# EAGLE design TinyQED (EAGLE 5.11)
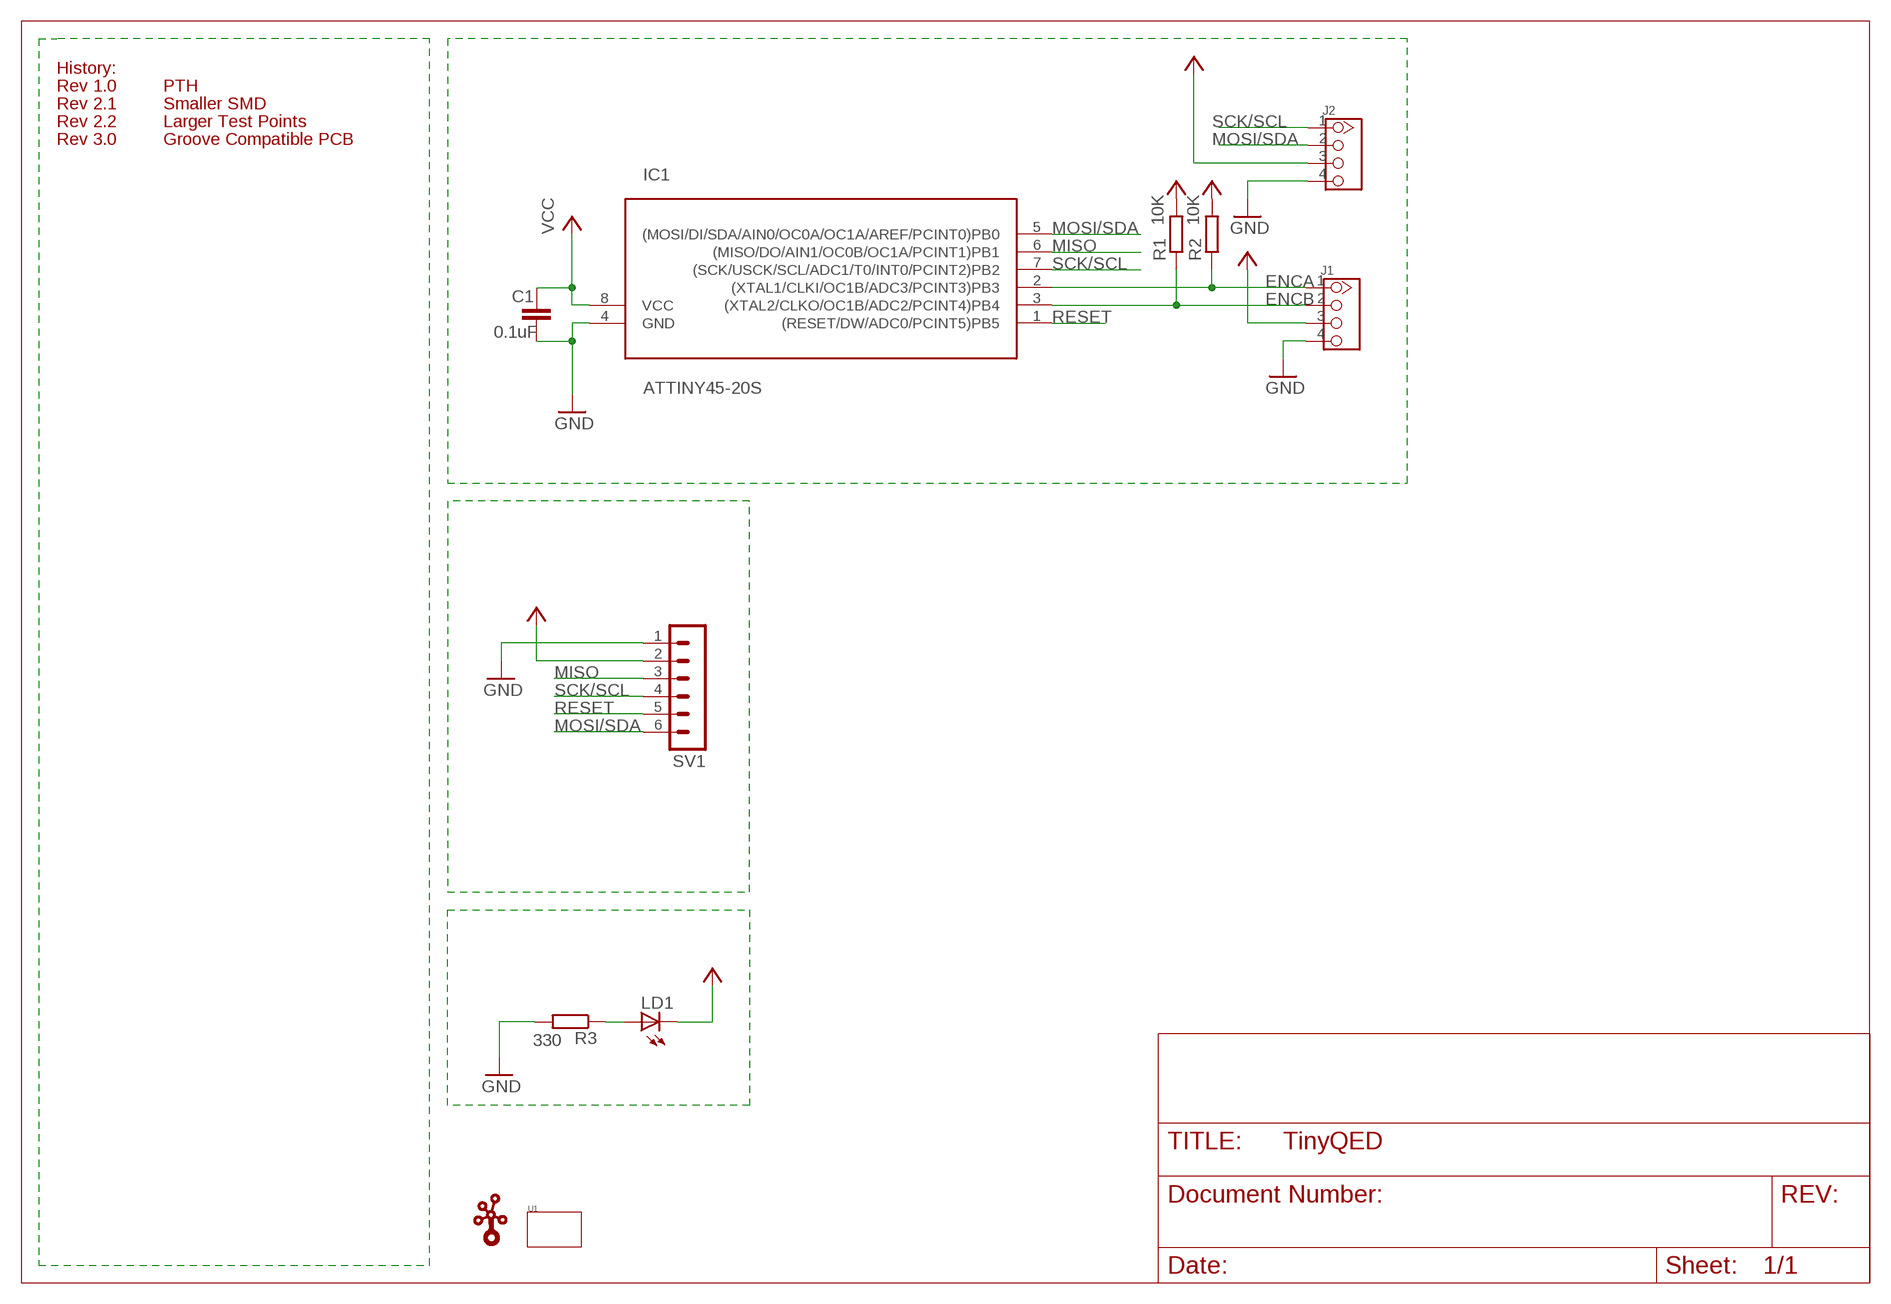
[diagram p0: schematic, sheet 1]

## Parts
C1  0.1uF  C-EUC0805  [C0805]
IC1  ATTINY45-20S  [SOIC8]
J1  TWIG_2.0  [2.0_1X4]
J2  TWIG_2.0  [2.0_1X4]
LD1  LEDCHIP-LED0805  [CHIP-LED0805]
R1  10K  R-EU_M0805  [M0805]
R2  10K  R-EU_M0805  [M0805]
R3  330  R-EU_M0805  [M0805]
SV1  MA06-1  [MA06-1]
U1  TWIG-2U  [2U-DIM-W/-DRILL]
U$1  LOGO-TWIGTWIGLOGO_SMALL  [TWIGLOGO_SMALL]

## Nets
ENCA: IC1.2((XTAL1/CLKI/OC1B/ADC3/PCINT3)PB3) J1.1 R2.1
ENCB: IC1.3((XTAL2/CLKO/OC1B/ADC2/PCINT4)PB4) J1.2 R1.1
GND: C1.2 IC1.4(GND) J1.4 J2.4 R3.2 SV1.1
MISO: IC1.6((MISO/DO/AIN1/OC0B/OC1A/PCINT1)PB1) SV1.3
MOSI/SDA: IC1.5((MOSI/DI/SDA/AIN0/OC0A/OC1A/AREF/PCINT0)PB0) J2.2 SV1.6
N$1: LD1.A R3.1
RESET: IC1.1((RESET/DW/ADC0/PCINT5)PB5) SV1.5
SCK/SCL: IC1.7((SCK/USCK/SCL/ADC1/T0/INT0/PCINT2)PB2) J2.1 SV1.4
VCC: C1.1 IC1.8(VCC) J1.3 J2.3 LD1.C R1.2 R2.2 SV1.2

## Notes on the sheet
- History:
- Rev 1.0 | PTH
- Rev 2.1 | Smaller SMD
- Rev 2.2 | Larger Test Points
- Rev 3.0 | Groove Compatible PCB

## Library data of the parts
C1 = rcl:C-EU: CAPACITOR, European symbol
IC1 = avr:ATTINY45: MICROCONTROLLER 4 Kbytes FLASH 256 bytes EEPROM 256 bytes RAM 4-channel 10 bit ADC USI
J1 J2 = CONNECTER:TWIG_2.0
LD1 = led:LED: LED OSRAM: - CHIPLED LG R971, LG N971, LY N971, LG Q971, LY Q971, LO R971, LY R971 LH N974, LH R974 LS Q976, LO Q976, LY Q976 LO Q996 - Hyper CHIPLED LW Q18S LB Q993, LB Q99A, LB R99A - SideLED LS A670, LO A670, LY A670, LG A670, LP A670 LB A673, LV A673, LT A673, LW A673 LH A674 LY A675 LS A676, LA A676, LO A676, LY A676, LW A676 LS A679, LY A679, LG A679 - Hyper Micro SIDELED® LS Y876, LA Y876, LO Y876, LY Y876 LT Y87S - SmartLED LW L88C, LW L88S LB L89C, LB L89S, LG L890 LS L89K, LO L89K, LY L89K LS L896, LA L896, LO L896, LY L896 - TOPLED LS T670, LO T670, LY T670, LG T670, LP T670 LSG T670, LSP T670, LSY T670, LOP T670, LYG T670 LG T671, LOG T671, LSG T671 LB T673, LV T673, LT T673, LW T673 LH T674 LS T676, LA T676, LO T676, LY T676, LB T676, LH T676, LSB T676, LW T676 LB T67C, LV T67C, LT T67C, LS T67K, LO T67K, LY T67K, LW E67C LS E67B, LA E67B, LO E67B, LY E67B, LB E67C, LV E67C, LT E67C LW T67C LS T679, LY T679, LG T679 LS T770, LO T770, LY T770, LG T770, LP T770 LB T773, LV T773, LT T773, LW T773 LH T774 LS E675, LA E675, LY E675, LS T675 LS T776, LA T776, LO T776, LY T776, LB T776 LHGB T686 LT T68C, LB T68C - Hyper Mini TOPLED® LB M676 - Mini TOPLED Santana® LG M470 LS M47K, LO M47K, LY M47K Source: http://www.osram.convergy.de LUXEON: - LUMILED® LXK2-PW12-R00, LXK2-PW12-S00, LXK2-PW14-U00, LXK2-PW14-V00 LXK2-PM12-R00, LXK2-PM12-S00, LXK2-PM14-U00 LXK2-PE12-Q00, LXK2-PE12-R00, LXK2-PE12-S00, LXK2-PE14-T00, LXK2-PE14-U00 LXK2-PB12-K00, LXK2-PB12-L00, LXK2-PB12-M00, LXK2-PB14-N00, LXK2-PB14-P00, LXK2-PB14-Q00 LXK2-PR12-L00, LXK2-PR12-M00, LXK2-PR14-Q00, LXK2-PR14-R00 LXK2-PD12-Q00, LXK2-PD12-R00, LXK2-PD12-S00 LXK2-PH12-R00, LXK2-PH12-S00 LXK2-PL12-P00, LXK2-PL12-Q00, LXK2-PL12-R00 Source: www.luxeon.com KINGBRIGHT: KA-3528ASYC Source: www.kingbright.com
R1-R3 = rcl:R-EU_: RESISTOR, European symbol
SV1 = con-lstb:MA06-1: PIN HEADER; OC_FARNELL: unknown; OC_NEWARK: unknown
U1 = Module:TWIG
U$1 = Logo:LOGO-TWIG

## Board
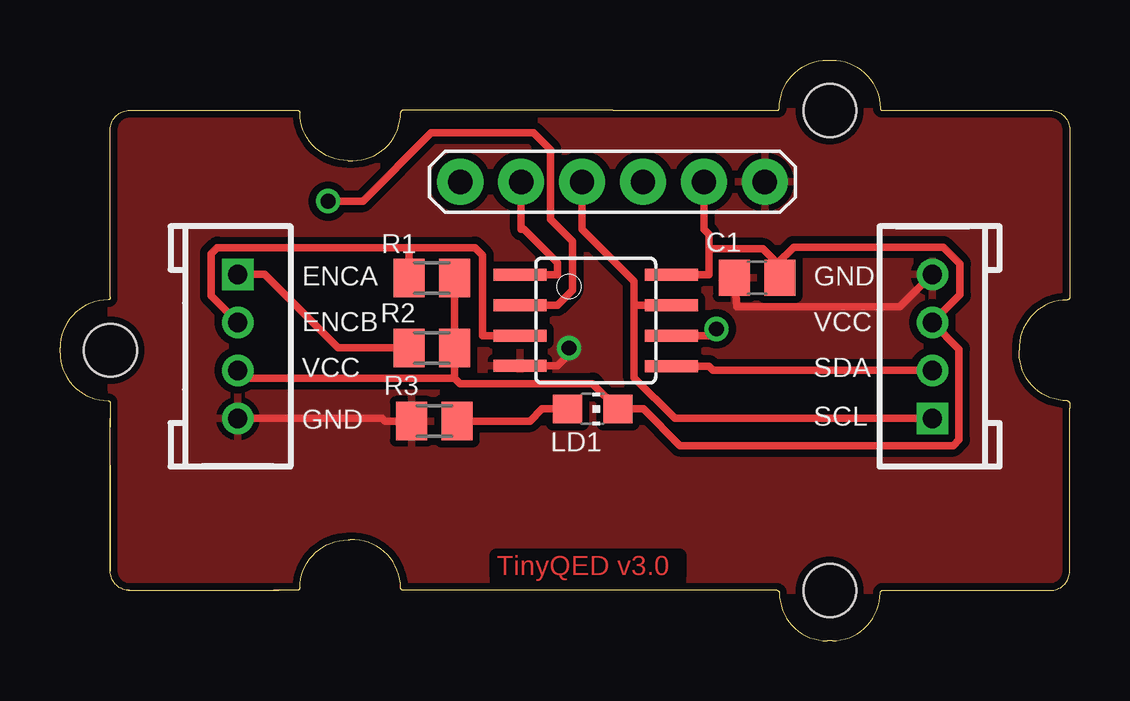
[diagram p1: board, top side]
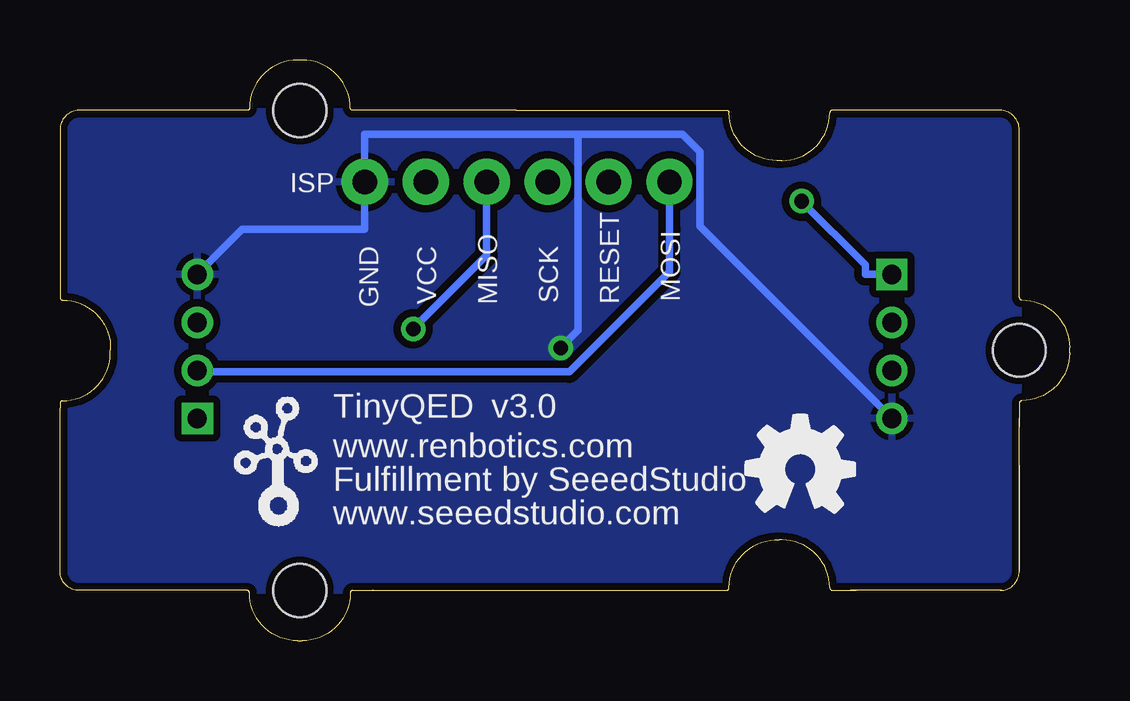
[diagram p2: board, bottom side, seen from below]

Size 42.09 x 24.2 mm. Coordinates in mm from the lower left corner, seen from the top.
Copper layers (1*16): Top 0.035mm / dielectric 1.5mm / Bottom 0.035mm
Design rules "Fusion_eagle_rule_v1.1": minimum track width 6mil, minimum drill 12mil, track to track 6mil, track to pad 6mil, pad to pad 6mil, via to via 6mil, smd to smd 0mil, copper to edge 10mil, drill to drill 10mil, minimum pad ring 10mil, minimum via ring 6mil, stop-mask expansion 2mil, vias tented up to drill 100mil, thermal gap 10mil

### Footprints (pad centres in the part's own frame; a part is rotated, then mirrored left to right if it is on the bottom)
C0805 = smd 1.3 x 1.5: 1 -0.95,0; 2 0.95,0
SOIC8 = smd 0.5 x 2.2: 1 -1.905,-3.154; 2 -0.645,-3.154; 3 0.625,-3.154; 4 1.895,-3.154; 5 1.905,3.154; 6 0.635,3.154; 7 -0.635,3.154; 8 -1.905,3.154
2.0_1X4 = drill 0.8 pad 1.27 square: 1 -3,0 | drill 0.8 pad 1.27 round: 2 -1,0; 3 1,0; 4 3,0
CHIP-LED0805 = smd 1.2 x 1.2: A 0,-1.05; C 0,1.05
M0805 = smd 1.3 x 1.6: 1 -0.95,0; 2 0.95,0
MA06-1 = drill 1.016 pad 1.93 round: 1 -6.35,0; 2 -3.81,0; 3 -1.27,0; 4 1.27,0; 5 3.81,0; 6 6.35,0
2U-DIM-W/-DRILL = hole 2.2: 10.453,-10.42; 10.453,9.58; -19.535,-0.415

### Placement (x,y rotation side)
C1  29.06,15.12 180 top
IC1  22.33,13.35 270 top
J1  7.41,12.27 270 top
J2  36.37,12.27 90 top
LD1  22.21,9.66 270 top
R1  15.5,15.12 0 top
R2  15.5,12.2 0 top
R3  15.6,9.15 180 top
SV1  23.03,19.12 180 top
U1  21.64,12.52 0 top
U$1  35.22,4.65 0 bottom
U$2  [OSHW2]  8.68,5.41 0 top

### Tracks (layer width: path | path; a pad name or v marks a point on that pad's centre or on a via)
ENCA  (via drill 0.61 pad 1.02)
  Top 0.305: IC1.2 20.74,13.99 21.36,14.61 21.36,16.64 20.44,17.56 20.44,20.47 19.74,21.17 15.48,21.17 12.63,18.32 v11.18,18.32 | R2.1 11.59,12.2 8.52,15.27 J1.1
  Bottom 0.305: J1.1 8.52,15.27 8.52,15.66 v11.18,18.32
ENCB
  Top 0.305: J1.2 6.3,14.38 6.3,16.13 6.55,16.38 14.55,16.38 | IC1.3 17.62,12.72 17.62,16.06 17.3,16.38 14.55,16.38 | 14.55,16.38 R1.1
GND  (via drill 0.61 pad 1.02)
  Top 0.305: v21.22,12.2 21.22,11.93 20.74,11.45 IC1.4 | R3.2 13.55,9.15 13.43,9.27 J1.4 | C1.2 28.22,13.92 35.02,13.92 J2.4
  Bottom 0.305: 20.49,21.11 20.49,12.93 v21.22,12.2 | 20.49,21.11 29.38,21.11 SV1.1 29.38,17.14 34.49,17.14 J2.4 | J1.4 15.41,17.27 15.41,20.39 16.13,21.11 20.49,21.11
  pour Top (isolate 0.305): 2.08,22.04 2.2,2.11 42.08,2.11 42.08,22.04
  pour Bottom (isolate 0.305): 2.08,22.04 2.2,2.11 42.08,2.11 42.08,22.04
MISO  (via drill 0.61 pad 1.02)
  Top 0.305: v27.36,12.99 27.33,12.99 27.05,12.71 IC1.6
  Bottom 0.305: SV1.3 24.3,16.06 v27.36,12.99
MOSI/SDA
  Top 0.305: IC1.5 27.05,11.44 27.22,11.27 J2.2
  Bottom 0.305: J2.2 36.31,11.2 20.86,11.2 16.68,15.38 16.68,17.14 SV1.6
N$1
  Top 0.305: LD1.A 20.1,9.66 19.59,9.15 R3.1
RESET
  Top 0.305: IC1.1 20.74,15.25 20.74,15.75 19.35,17.14 19.22,17.14 SV1.5
SCK/SCL
  Top 0.305: J2.1 25.63,9.27 23.93,10.97 23.93,13.98 | SV1.4 21.76,17.14 23.93,14.97 23.93,13.98 | 23.93,13.98 IC1.7
VCC
  Top 0.305: 29.92,15.73 29.31,16.33 27.05,16.33 | 27.05,16.33 27.05,15.25 IC1.8 | 27.05,16.33 27.05,16.94 26.84,17.14 SV1.2 | 29.92,15.73 30.59,16.4 36.82,16.4 37.51,15.71 37.51,14.41 J2.3 37.48,12.15 37.48,8.38 37.23,8.13 25.84,8.13 24.31,9.66 LD1.C 22.2,10.72 16.68,10.72 16.45,10.94 | 29.92,15.73 C1.1 | J1.3 7.73,10.94 16.45,10.94 | 16.45,10.94 R2.2 R1.2

### Text on the board
Top: TinyQED v3.0
tNames: ENCA | GND | ENCB | VCC | VCC | SDA | GND | SCL
bNames: ISP | RESET | MOSI | SCK | MISO | VCC | GND | v3.0 | TinyQED | www.renbotics.com | Fulfillment by SeeedStudio | www.seeedstudio.com